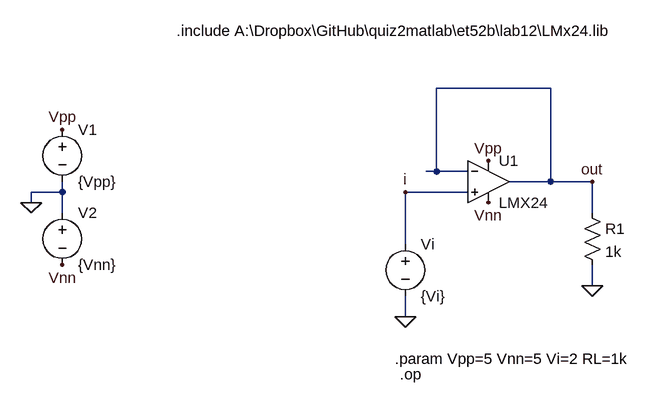
[diagram p0: schematic lab12d.asc]
lab12d.asc, the LTspice schematic file:
Version 4
SHEET 1 988 680
WIRE 112 32 -64 32
WIRE -64 160 -64 32
WIRE -64 160 -80 160
WIRE -16 160 -64 160
WIRE 112 176 112 32
WIRE 112 176 48 176
WIRE 176 176 112 176
WIRE -640 192 -640 176
WIRE -640 192 -688 192
WIRE -16 192 -112 192
WIRE -688 208 -688 192
WIRE -640 224 -640 192
WIRE 176 224 176 176
WIRE -112 272 -112 192
WIRE 176 336 176 304
WIRE -112 384 -112 352
FLAG 16 144 Vpp
FLAG 16 208 Vnn
FLAG -688 208 0
FLAG -640 96 Vpp
FLAG -640 304 Vnn
FLAG -112 384 0
FLAG 176 176 out
FLAG 176 336 0
FLAG -112 192 i
SYMBOL Opamps\\opamp2 16 112 R0
SYMATTR InstName U1
SYMATTR Value LMX24
SYMBOL voltage -640 80 R0
SYMATTR InstName V1
SYMATTR Value {Vpp}
SYMBOL voltage -640 208 R0
SYMATTR InstName V2
SYMATTR Value {Vnn}
SYMBOL voltage -112 256 R0
SYMATTR InstName Vi
SYMATTR Value {Vi}
SYMBOL res 160 208 R0
SYMATTR InstName R1
SYMATTR Value 1k
TEXT -464 -56 Left 2 !.include A:\\Dropbox\\GitHub\\quiz2matlab\\et52b\\lab12\\LMx24.lib
TEXT -128 448 Left 2 !.param Vpp=5 Vnn=5 Vi=2 RL=1k
TEXT -120 472 Left 2 !.op

The netlist it stands for:
* lab12d.asc
XU1 i out Vpp Vnn out LMX24  ; pins In+ In- V+ V- OUT
V1 Vpp 0 {Vpp}
V2 0 Vnn {Vnn}
Vi i 0 {Vi}
R1 out 0 1k
.include A:\Dropbox\GitHub\quiz2matlab\et52b\lab12\LMx24.lib
.param Vpp=5 Vnn=5 Vi=2 RL=1k
.op
.backanno
.end